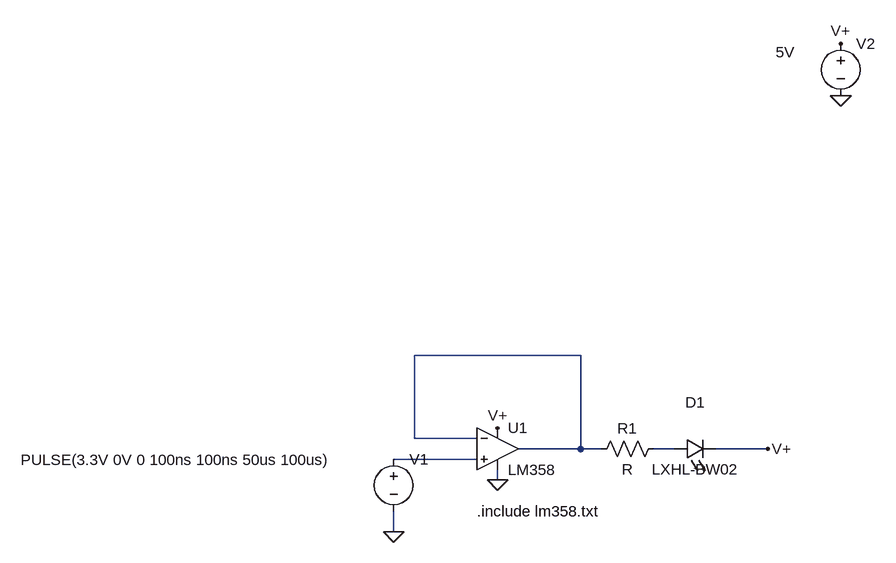
[diagram p0: schematic Draft1.asc]
Draft1.asc, the LTspice schematic file:
Version 4
SHEET 1 880 680
WIRE 272 16 16 16
WIRE 16 144 16 16
WIRE 112 144 16 144
WIRE 272 160 272 16
WIRE 272 160 176 160
WIRE 304 160 272 160
WIRE 416 160 384 160
WIRE 560 160 480 160
WIRE 112 176 -16 176
WIRE 144 208 144 192
WIRE -16 288 -16 256
FLAG 144 208 0
FLAG -16 288 0
FLAG 672 -464 V+
FLAG 672 -384 0
FLAG 144 128 V+
FLAG 560 160 V+
SYMBOL Opamps\\opamp2 144 96 R0
SYMATTR InstName U1
SYMATTR Value LM358
SYMBOL voltage -16 160 R0
WINDOW 3 -574 17 Left 2
WINDOW 123 0 0 Left 2
WINDOW 39 0 0 Left 2
SYMATTR InstName V1
SYMATTR Value PULSE(3.3V 0V 0 100ns 100ns 50us 100us)
SYMBOL res 400 144 R90
WINDOW 0 0 56 VBottom 2
WINDOW 3 32 56 VTop 2
SYMATTR InstName R1
SYMBOL LED 416 176 R270
WINDOW 0 72 32 VTop 2
WINDOW 3 0 32 VBottom 2
SYMATTR InstName D1
SYMATTR Value LXHL-BW02
SYMBOL voltage 672 -480 R0
WINDOW 3 -100 29 Left 2
WINDOW 123 0 0 Left 2
WINDOW 39 0 0 Left 2
SYMATTR InstName V2
SYMATTR Value 5V
TEXT 112 256 Left 2 !.include lm358.txt

The netlist it stands for:
* Draft1.asc
XU1 N003 N001 V+ 0 N001 LM358  ; pins In+ In- V+ V- OUT
V1 N003 0 PULSE(3.3V 0V 0 100ns 100ns 50us 100us)
R1 N002 N001 R
D1 N002 V+ LXHL-BW02
V2 V+ 0 5V
.model D D
.lib standard.dio
.include lm358.txt
.backanno
.end